# EAGLE design shinobi_battery (EAGLE 8.2.2)
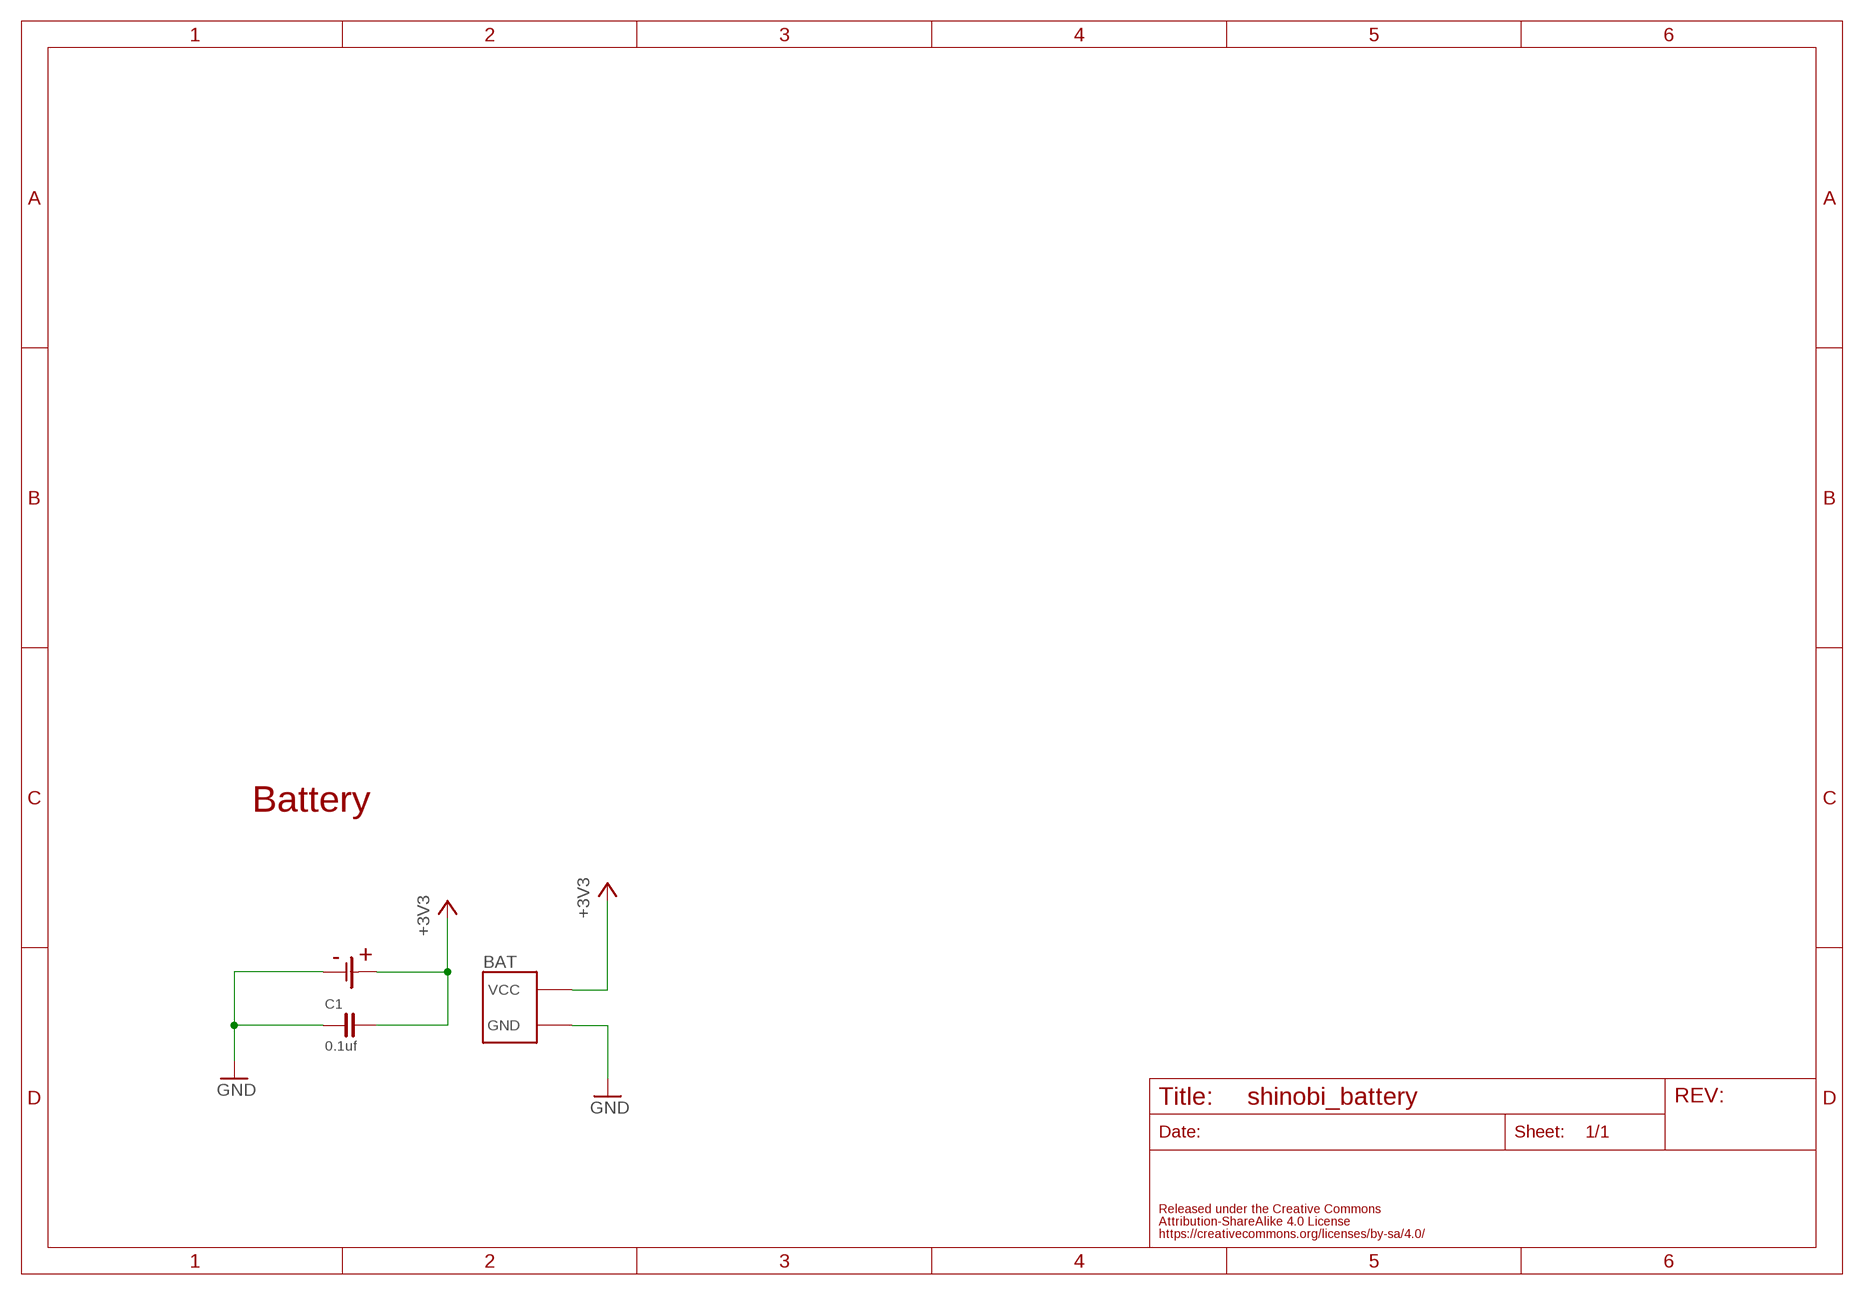
[diagram p0: schematic, sheet 1]

## Parts
BAT  FABO_BRICK_2PIN_SIDE  [FABO_BRICK_2PIN_S02B−PASK-2_SILK]
C1  0.1uf  CAPACITOR-0603  [0603]
U$1  CH031-2477FL  [CH031-2477FL]

## Nets
+3V3: BAT.VCC C1.2 U$1.+
GND: BAT.GND C1.1 U$1.-

## Notes on the sheet
- Battery

## Library data of the parts
BAT = FaBo-Template:FABO_BRICK_2PIN
C1 = FaBo-Capacitor:CAPACITOR: CAPACITOR
U$1 = FaBo-Supply:CH031-2477FL

## Board
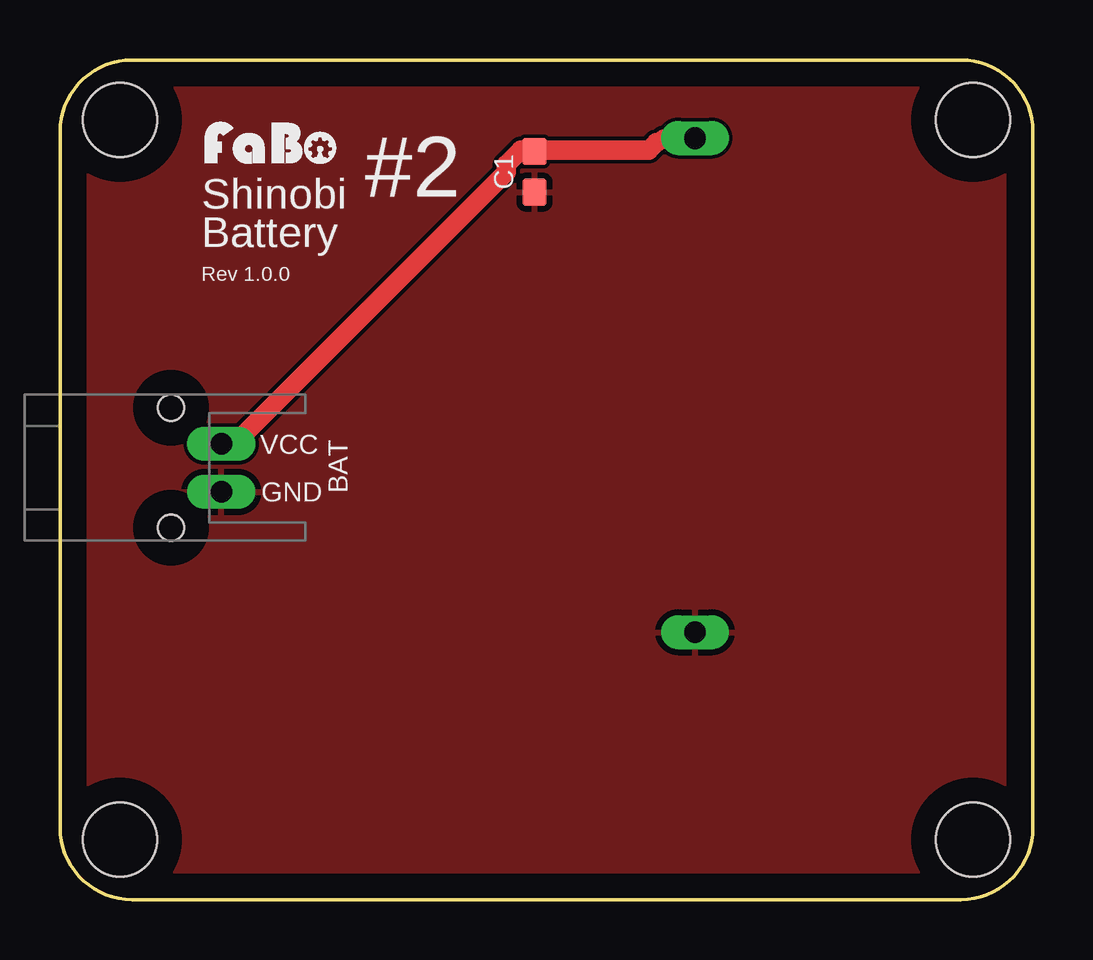
[diagram p1: board, top side]
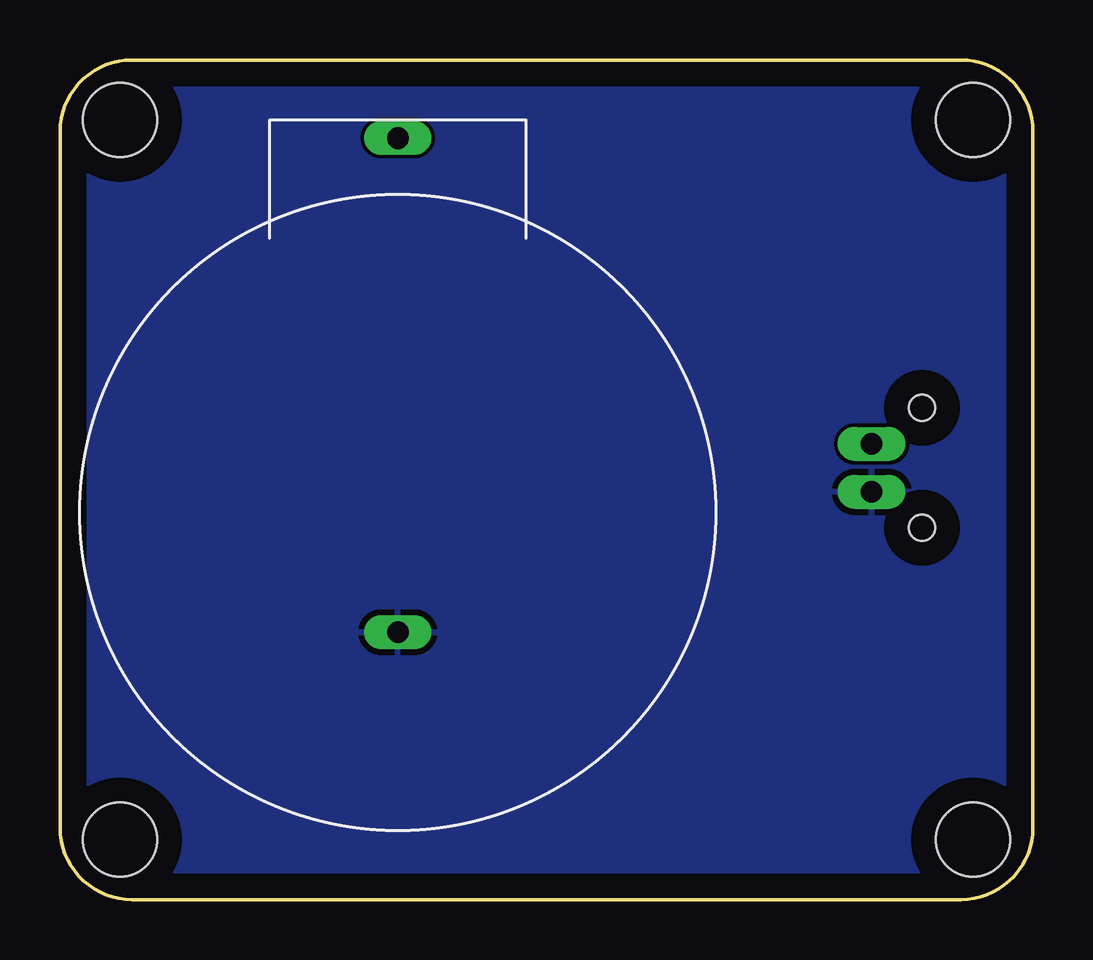
[diagram p2: board, bottom side, seen from below]

Size 40.54 x 35 mm. Coordinates in mm from the lower left corner, seen from the top.
Copper layers (1*16): Top 0.035mm / dielectric 1.5mm / Bottom 0.035mm
Design rules "default": minimum track width 6mil, minimum drill 0.35mm, track to track 6mil, track to pad 6mil, pad to pad 6mil, via to via 6mil, smd to smd 6mil, copper to edge 40mil, drill to drill 6mil, minimum pad ring 10mil, minimum via ring 8mil, stop-mask expansion 4mil, vias tented up to drill 0mil, thermal gap 10mil

### Footprints (pad centres in the part's own frame; a part is rotated, then mirrored left to right if it is on the bottom)
FABO_BRICK_2PIN_S02B−PASK-2_SILK = drill 0.9 pad 1.422 long: GND -1,-0.102; VCC 1,-0.102 | hole 1.1: 2.5,1.998; -2.5,1.998
0603 = smd 1.1 x 1: 1 -0.85,0; 2 0.85,0
CH031-2477FL = drill 0.9 long: + 0,13.06; - 0,-7.54
FABO-SHINOBI = hole 3.1: 2.5,32.5; 38.04,32.5; 38.04,2.5; 2.5,2.5

### Placement (x,y rotation side)
BAT  6.62,18 90 top
C1  19.77,30.34 90 top
U$1  26.46,18.68 0 top
U$2  [LOGO_FABO_S]  8.83,30.52 0 top
U$3  [FABO-SHINOBI]  0,0 0 top

### Tracks (layer width: path | path; a pad name or v marks a point on that pad's centre or on a via)
+3V3
  Top 0.152: 24.84,31.55 24.99,31.55 25.15,31.7 | 19.81,31.24 C1.2 19.66,31.24 | 26.36,31.7 U$1.+ | 6.86,19.05 BAT.VCC
  Top 0.813: 19.81,31.24 24.54,31.24 24.84,31.55 | 26.36,31.7 25.15,31.7 | 6.86,19.05 7.32,19.05 18.59,30.33 18.59,30.63 19.2,31.24 19.66,31.24
GND
  pour Bottom: 0,0 41,0 41,35 0,35
  pour Top: 0,0 41,0 41,35 0,35

### Text on the board
tPlace: Shinobi | #2 | Battery | Rev 1.0.0